# EAGLE schematic Debug Tester rev B (EAGLE 9.7.0)
COMPANY: ADAFRUIT INDUSTRIES; DRAWN: KTOWN; REV: B
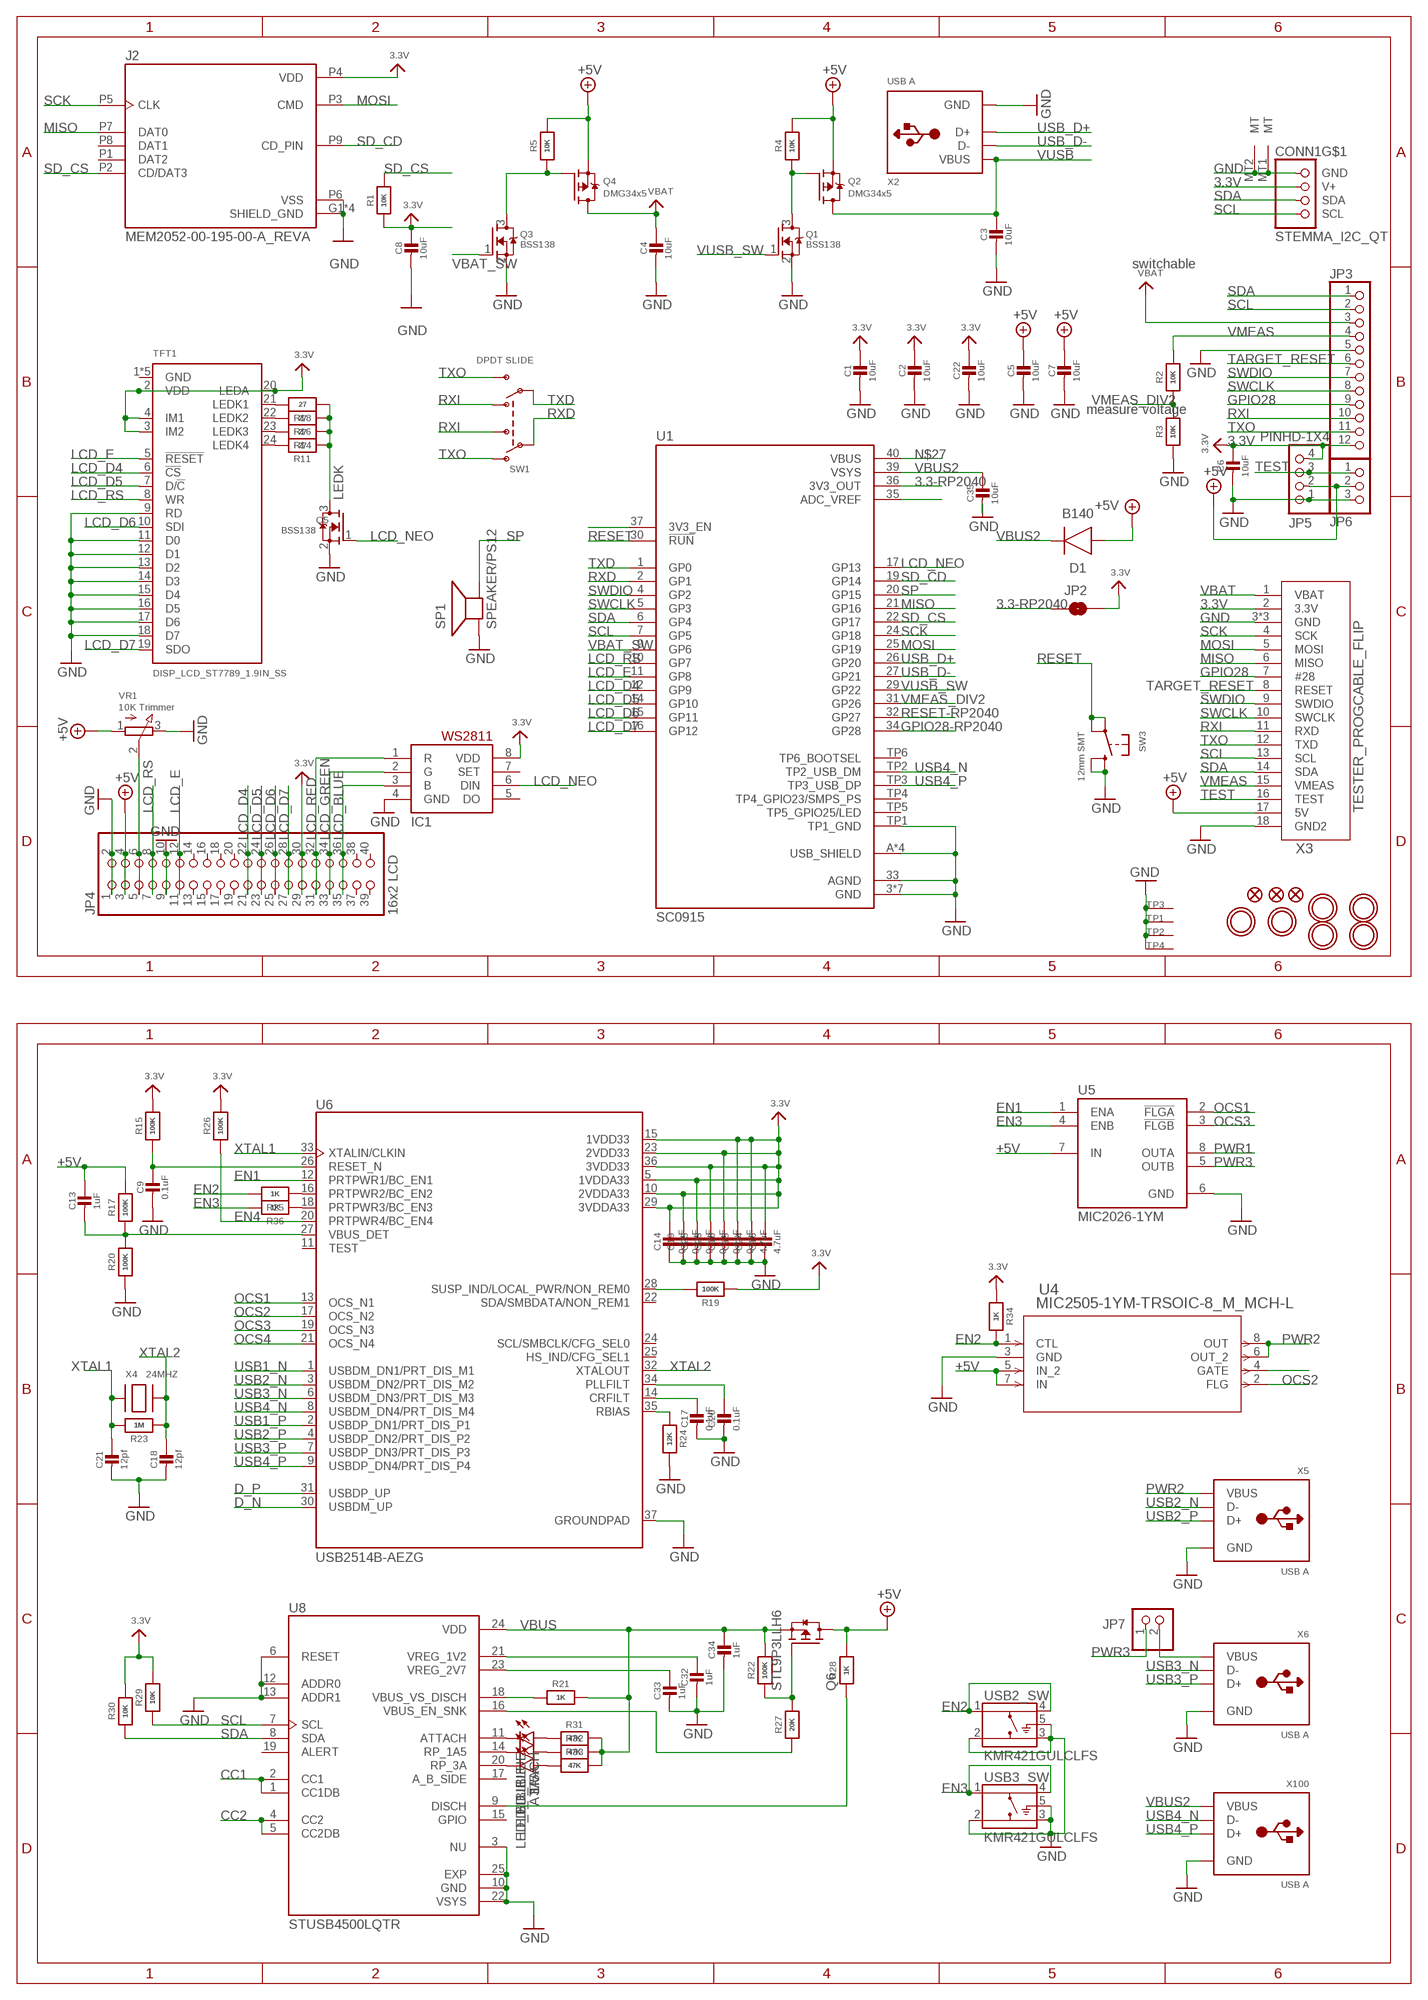
[diagram p0: schematic, sheet 1, part 1 of 2]
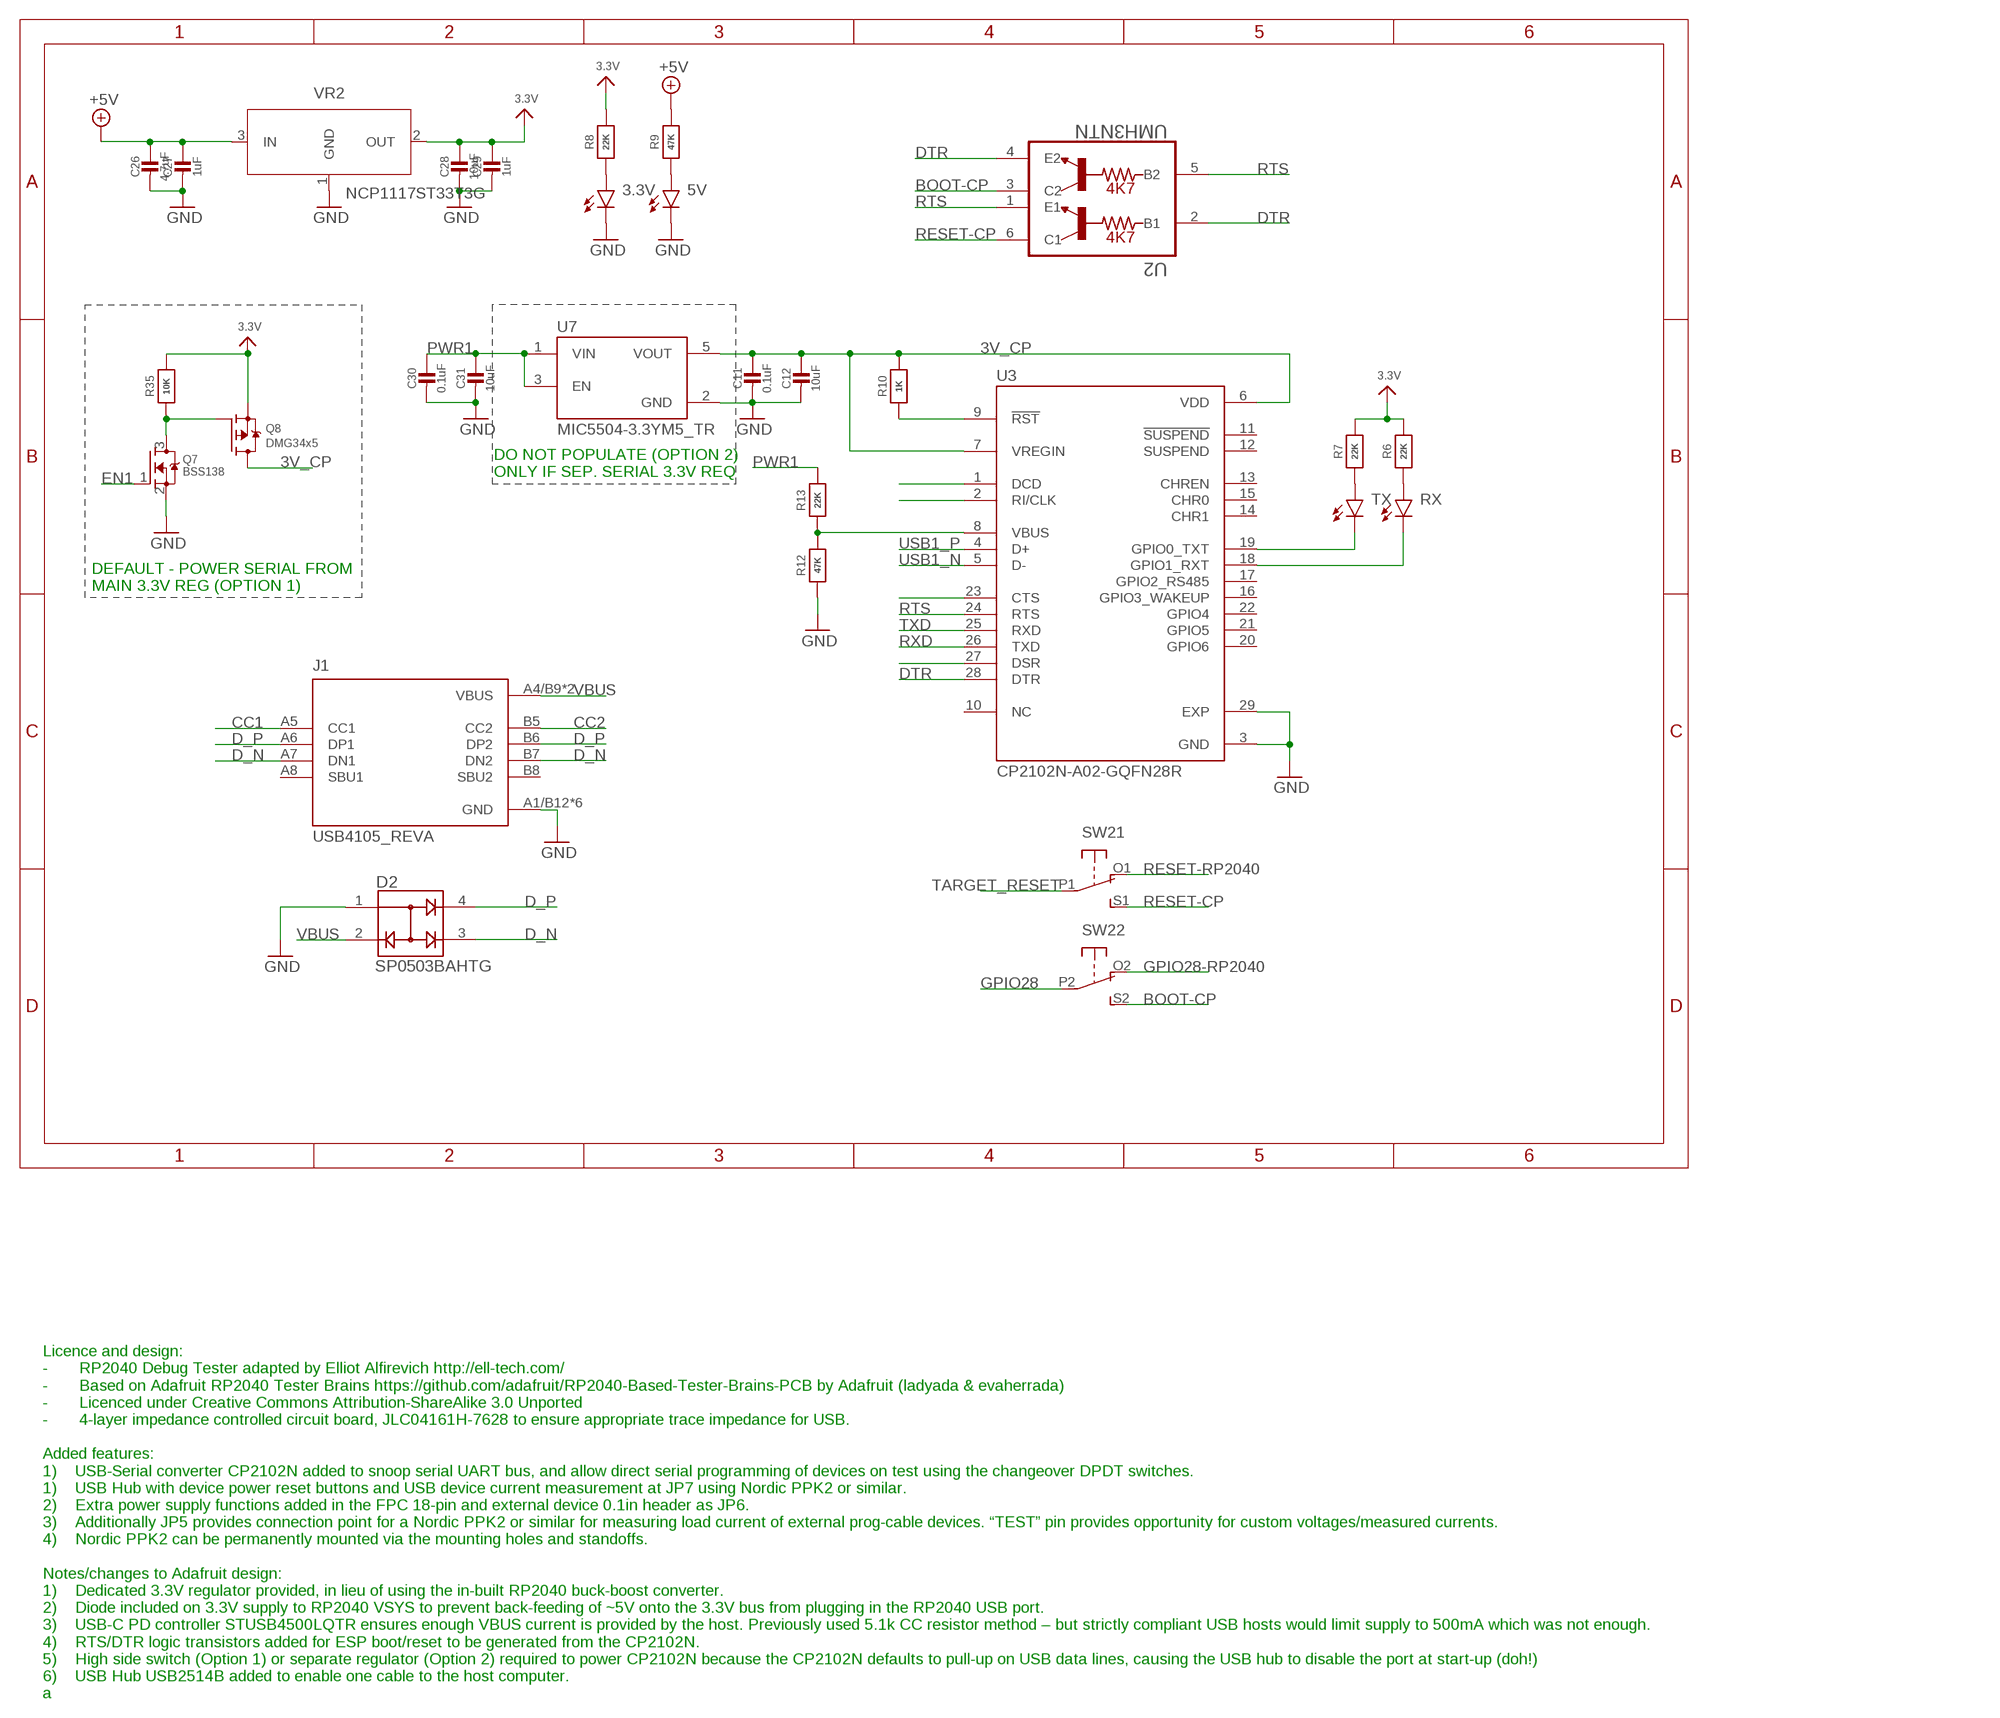
[diagram p1: schematic, sheet 1, part 2 of 2]

## Parts
1.5A  LED_BLUE  CHIP-FLAT-B_0603-0.55MM  [LEDC1608X55N_FLAT-B]
3.3V  LED_BLUE  CHIP-FLAT-B_0603-0.55MM  [LEDC1608X55N_FLAT-B]
3A  LED_BLUE  CHIP-FLAT-B_0603-0.55MM  [LEDC1608X55N_FLAT-B]
5V  LED_BLUE  CHIP-FLAT-B_0603-0.55MM  [LEDC1608X55N_FLAT-B]
$$U$1  MOUNTINGHOLE3.0THIN  [MOUNTINGHOLE_3.0_PLATEDTHIN]
$$U$2  MOUNTINGHOLE3.0THIN  [MOUNTINGHOLE_3.0_PLATEDTHIN]
$$U$3  MOUNTINGHOLE3.0THIN  [MOUNTINGHOLE_3.0_PLATEDTHIN]
$$U$5  MOUNTINGHOLE3.0THIN  [MOUNTINGHOLE_3.0_PLATEDTHIN]
$$U$6  MOUNTINGHOLE3.0THIN  [MOUNTINGHOLE_3.0_PLATEDTHIN]
ATTACH  LED_BLUE  CHIP-FLAT-B_0603-0.55MM  [LEDC1608X55N_FLAT-B]
C1  10uF  CAP_CERAMIC0603_NO  [0603-NO]
C2  10uF  CAP_CERAMIC0603_NO  [0603-NO]
C3  10uF  CAP_CERAMIC0603_NO  [0603-NO]
C4  10uF  CAP_CERAMIC0603_NO  [0603-NO]
C5  10uF  CAP_CERAMIC0603_NO  [0603-NO]
C6  10uF  CAP_CERAMIC0603_NO  [0603-NO]
C7  10uF  CAP_CERAMIC0603_NO  [0603-NO]
C8  10uF  CAP_CERAMIC0603_NO  [0603-NO]
C9  0.1uF  CAP_CERAMIC0603_NO  [0603-NO]
C10  0.1uF  CAP_CERAMIC0603_NO  [0603-NO]
C11  0.1uF  CAP_CERAMIC0603_NO  [0603-NO]
C12  10uF  CAP_CERAMIC0603_NO  [0603-NO]
C13  1uF  CAP_CERAMIC0603_NO  [0603-NO]
C14  0.1uF  CAP_CERAMIC0603_NO  [0603-NO]
C15  0.1uF  CAP_CERAMIC0603_NO  [0603-NO]
C16  4.7uF  CAP_CERAMIC0603_NO  [0603-NO]
C17  0.1uF  CAP_CERAMIC0603_NO  [0603-NO]
C18  12pf  CAP_CERAMIC0603_NO  [0603-NO]
C19  0.1uF  CAP_CERAMIC0603_NO  [0603-NO]
C20  0.1uF  CAP_CERAMIC0603_NO  [0603-NO]
C21  12pf  CAP_CERAMIC0603_NO  [0603-NO]
C22  10uF  CAP_CERAMIC0603_NO  [0603-NO]
C23  0.1uF  CAP_CERAMIC0603_NO  [0603-NO]
C24  4.7uF  CAP_CERAMIC0603_NO  [0603-NO]
C25  0.1uF  CAP_CERAMIC0603_NO  [0603-NO]
C26  4.7uF  CAP_CERAMIC0603_NO  [0603-NO]
C27  1uF  CAP_CERAMIC0603_NO  [0603-NO]
C28  10uF  CAP_CERAMIC0603_NO  [0603-NO]
C29  1uF  CAP_CERAMIC0603_NO  [0603-NO]
C30  0.1uF  CAP_CERAMIC0603_NO  [0603-NO]
C31  10uF  CAP_CERAMIC0603_NO  [0603-NO]
C32  1uF  CAP_CERAMIC0603_NO  [0603-NO]
C33  1uF  CAP_CERAMIC0603_NO  [0603-NO]
C34  1uF  CAP_CERAMIC0603_NO  [0603-NO]
C35  10uF  CAP_CERAMIC0603_NO  [0603-NO]
CONN1  STEMMA_I2C_QT  [JST_SH4]
D1  B140  DIODE_ES1D_SMA  [DIOM5226X290N]
D2  SP0503BAHTG  [SOT143]
FID1  FIDUCIAL_1MM  [FIDUCIAL_1MM]
FID2  FIDUCIAL_1MM  [FIDUCIAL_1MM]
FID3  FIDUCIAL_1MM  [FIDUCIAL_1MM]
IC1  WS2811-SOP8  [SO08-SKINNYPADS]
J1  USB4105_REVA  [GCT_USB4105_REVA]
J2  MEM2052-00-195-00-A_REVA  [GCT_MEM2052-00-195-00-A_REVA]
JP2  JUMPER-SMT_2_NC_PASTE_NO-SILK  JUMPER-SMT_2_NO_NO-SILK  [SMT-JUMPER_2_NO_NO-SILK]
JP3  HEADER-1X12OVAL  [1X12_OVAL]
JP4  16x2 LCD  PINHD-2X20_SMT  [2X20_SMT_MALE]
JP5  PINHD-1X4  [1X04]
JP6  PINHD-1X3/90  [1X03/90]
JP7  PINHD-1X2  [1X02]
Q1  BSS138  MOSFET-NWIDE  [SOT23-WIDE]
Q2  DMG34x5  MOSFET-PWIDE  [SOT23-WIDE]
Q3  BSS138  MOSFET-NWIDE  [SOT23-WIDE]
Q4  DMG34x5  MOSFET-PWIDE  [SOT23-WIDE]
Q5  BSS138  MOSFET-NWIDE  [SOT23-WIDE]
Q6  STL9P3LLH6  [TRANS_STL9P3LLH6]
Q7  BSS138  MOSFET-NWIDE  [SOT23-WIDE]
Q8  DMG34x5  MOSFET-PWIDE  [SOT23-WIDE]
R1  10K  RESISTOR_0603_NOOUT  [0603-NO]
R2  10K  RESISTOR_0603_NOOUT  [0603-NO]
R3  10K  RESISTOR_0603_NOOUT  [0603-NO]
R4  10K  RESISTOR_0603_NOOUT  [0603-NO]
R5  10K  RESISTOR_0603_NOOUT  [0603-NO]
R6  22K  RESISTOR_0603_NOOUT  [0603-NO]
R7  22K  RESISTOR_0603_NOOUT  [0603-NO]
R8  22K  RESISTOR_0603_NOOUT  [0603-NO]
R9  47K  RESISTOR_0603_NOOUT  [0603-NO]
R10  1K  RESISTOR_0603_NOOUT  [0603-NO]
R11  27  RESISTOR_0603_NOOUT  [0603-NO]
R12  47K  RESISTOR_0603_NOOUT  [0603-NO]
R13  22K  RESISTOR_0603_NOOUT  [0603-NO]
R14  27  RESISTOR_0603_NOOUT  [0603-NO]
R15  100K  RESISTOR_0603_NOOUT  [0603-NO]
R16  27  RESISTOR_0603_NOOUT  [0603-NO]
R17  100K  RESISTOR_0603_NOOUT  [0603-NO]
R18  27  RESISTOR_0603_NOOUT  [0603-NO]
R19  100K  RESISTOR_0603_NOOUT  [0603-NO]
R20  100K  RESISTOR_0603_NOOUT  [0603-NO]
R21  1K  RESISTOR_0603_NOOUT  [0603-NO]
R22  100K  RESISTOR_0603_NOOUT  [0603-NO]
R23  1M  RESISTOR_0603_NOOUT  [0603-NO]
R24  12K  RESISTOR_0603_NOOUT  [0603-NO]
R25  1K  RESISTOR_0603_NOOUT  [0603-NO]
R26  100K  RESISTOR_0603_NOOUT  [0603-NO]
R27  20K  RESISTOR_0603_NOOUT  [0603-NO]
R28  1K  RESISTOR_0603_NOOUT  [0603-NO]
R29  10K  RESISTOR_0603_NOOUT  [0603-NO]
R30  10K  RESISTOR_0603_NOOUT  [0603-NO]
R31  47K  RESISTOR_0603_NOOUT  [0603-NO]
R32  47K  RESISTOR_0603_NOOUT  [0603-NO]
R33  47K  RESISTOR_0603_NOOUT  [0603-NO]
R34  1K  RESISTOR_0603_NOOUT  [0603-NO]
R35  10K  RESISTOR_0603_NOOUT  [0603-NO]
R36  1K  RESISTOR_0603_NOOUT  [0603-NO]
RX  LED_BLUE  CHIP-FLAT-B_0603-0.55MM  [LEDC1608X55N_FLAT-B]
SP1  SPEAKER/PS12  [PS12]
SW1  DPDT SLIDE  SWITCH_DPDTEG1390  [EG1390]
SW2  DPDT-EG1390  [EG1390]
SW3  12mm SMT  SWITCH_TACT_SMT_12MM  [B3F-40XX-SMT]
TFT1  DISP_LCD_ST7789_1.9IN_SS  [TFT_1.9IN_170X320_30P_SS]
TP1  SEWTAP_SMTNUTM3  [SMT_NUT_3MM]
TP2  SEWTAP_SMTNUTM3  [SMT_NUT_3MM]
TP3  SEWTAP_SMTNUTM3  [SMT_NUT_3MM]
TP4  SEWTAP_SMTNUTM3  [SMT_NUT_3MM]
TX  LED_BLUE  CHIP-FLAT-B_0603-0.55MM  [LEDC1608X55N_FLAT-B]
U1  SC0915  [MODULE_SC0915]
U2  UMH3NTN  [SOP65P210X100-6N]
U3  CP2102N-A02-GQFN28R  [IC_CP2102N-A02-GQFN28R]
U4  MIC2505-1YM-TRSOIC-8_M_MCH-L  [SOIC-8_M_MCH-L]
U5  MIC2026-1YM  [SOIC127P599X173-8N]
U6  USB2514B-AEZG  [VQFN50P600X600X100-36N]
U7  MIC5504-3.3YM5_TR  [SOT95P280X145-5N]
U8  STUSB4500LQTR  [QFN50P400X400X100-25N]
U$7  MOUNTINGHOLE3.0THIN  [MOUNTINGHOLE_3.0_PLATEDTHIN]
USB2_SW  KMR421GULCLFS  [SW_KMR421GULCLFS]
USB3_SW  KMR421GULCLFS  [SW_KMR421GULCLFS]
VR1  10K Trimmer  TRIMPOTTC33X-2  [TRIMPOT_BOURNS_TC33X-2]
VR2  NCP1117ST33T3G  NCP1117ST33T3GSOT-223  [SOT230P700X170-4]
X2  USB A  USB_TYPEA_SMT  [USB_HOST-SMT]
X3  TESTER_PROGCABLE_FLIP  [FPC_0.5MM_18PIN]
X4  24MHZ  XTALNX5032  [NX5032]
X5  USB A  USB_TYPEA_SMT  [USB_HOST-SMT]
X6  USB A  USB_TYPEA_SMT  [USB_HOST-SMT]
X100  USB A  USB_TYPEA_SMT  [USB_HOST-SMT]

## Nets
3.3-RP2040: JP2.1 U1.36(3V3_OUT)
3.3V: C1.1 C2.1 C6.1 C8.1 C10.1 C14.1 C15.1 C16.1 C19.1 C22.1 C23.1 C24.1 C25.1 C28.1 C29.1 CONN1.2(V+) IC1.8(VDD) J2.P4(VDD) JP2.2 JP3.12 JP4.29 JP4.30 JP5.4 Q8.2(S) R1.1 R6.2 R7.2 R8.2 R15.2 R19.1 R26.2 R29.2 R30.2 R34.1 R35.2 TFT1.2(VDD) TFT1.3(IM2) TFT1.4(IM1) TFT1.20(LEDA) U6.5(1VDDA33) U6.10(2VDDA33) U6.15(1VDD33) U6.23(2VDD33) U6.29(3VDDA33) U6.36(3VDD33) VR2.2(OUT) X3.2(3.3V)
3V_CP: C11.1 C12.1 Q8.3(D) R10.2 U3.6(VDD) U3.7(VREGIN) U7.5(VOUT)
!VBAT_SW1: Q3.3(D) Q4.1(G) R5.1
!VBAT_SW2: Q1.3(D) Q2.1(G) R4.1
+5V: C5.1 C7.1 C13.1 C26.1 C27.1 D1.2(A) JP4.3 JP4.4 JP5.2 JP6.2 Q2.2(S) Q4.2(S) Q6.5(D) Q6.5_1(D) Q6.5_2(D) R4.2 R5.2 R9.2 R17.2 R28.2 U4.5(IN_2) U4.7(IN) U5.7(IN) VR1.1(A) VR2.3(IN) X3.17(5V)
BOOT-CP: SW2.S2(2:S) U2.3(C2)
CC1: J1.A5(CC1) U8.1(CC1DB) U8.2(CC1)
CC2: J1.B5(CC2) U8.4(CC2) U8.5(CC2DB)
D_N: D2.3 J1.A7(DN1) J1.B7(DN2) U6.30(USBDM_UP)
D_P: D2.4 J1.A6(DP1) J1.B6(DP2) U6.31(USBDP_UP)
DTR: U2.2(B1) U2.4(E2) U3.28(DTR)
EN1: Q7.1(G) U5.1(ENA) U6.12(PRTPWR1/BC_EN1)
EN2: R25.2 R34.2 U4.1(CTL) USB2_SW.1 USB2_SW.4
EN3: R36.2 U5.4(ENB) USB3_SW.1 USB3_SW.4
EN4: R26.1 U6.20(PRTPWR4/BC_EN4)
GND: 3.3V.C 5V.C C1.2 C2.2 C3.2 C4.2 C5.2 C6.2 C7.2 C8.2 C9.2 C10.2 C11.2 C12.2 C14.2 C15.2 C16.2 C17.2 C18.2 C19.2 C20.2 C21.2 C22.2 C23.2 C24.2 C25.2 C26.2 C27.2 C28.2 C29.2 C30.2 C31.2 C32.2 C33.2 C34.2 C35.2 CONN1.1(GND) CONN1.MT1(MT) CONN1.MT2(MT) D2.1 IC1.4(GND) J1.A1/B12(GND) J1.B1/A12(GND) J1.G1(GND) J1.G2(GND) J1.G3(GND) J1.G4(GND) J2.G1(SHIELD_GND) J2.G2(SHIELD_GND) J2.G3(SHIELD_GND) J2.G4(SHIELD_GND) J2.P6(VSS) JP3.5 JP4.1 JP4.2 JP4.9 JP4.10 JP5.1 JP6.3 Q1.2(S) Q3.2(S) Q5.2(S) Q7.2(S) R3.1 R12.1 R20.1 R24.2 SP1.P$1(+) SW3.P$3(S) SW3.P$4(S1) TFT1.9(RD) TFT1.11(D0) TFT1.12(D1) TFT1.13(D2) TFT1.14(D3) TFT1.15(D4) TFT1.16(D5) TFT1.17(D6) TFT1.18(D7) TP1.P$1(SEW) TP2.P$1(SEW) TP3.P$1(SEW) TP4.P$1(SEW) U1.3(GND) U1.8(GND) U1.13(GND) U1.18(GND) U1.23(GND) U1.28(GND) U1.33(AGND) U1.38(GND) U1.A(USB_SHIELD) U1.B(USB_SHIELD) U1.C(USB_SHIELD) U1.D(USB_SHIELD) U1.TP1(TP1_GND) U3.3(GND) U3.29(EXP) U4.3(GND) U5.6(GND) U6.37(GROUNDPAD) U7.2(GND) U8.3(NU) U8.6(RESET) U8.10(GND) U8.12(ADDR0) U8.13(ADDR1) U8.22(VSYS) U8.25(EXP) USB2_SW.2 USB2_SW.3 USB2_SW.5(G) USB3_SW.2 USB3_SW.3 USB3_SW.5(G) VR1.3(E) VR2.1(GND) X2.GND X3.3(GND) X3.18(GND2) X3.SUPPORT1(GND) X3.SUPPORT2(GND) X5.GND X6.GND X100.GND
GPIO28: JP3.9 SW2.P2(2:P) X3.7(#28)
GPIO28-RP2040: SW2.O2(2:O) U1.34(GP28)
LCD_BLUE: IC1.3(B) JP4.35 JP4.36
LCD_D4: JP4.21 JP4.22 TFT1.6(!CS) U1.12(GP9)
LCD_D5: JP4.23 JP4.24 TFT1.7(D/!C) U1.14(GP10)
LCD_D6: JP4.25 JP4.26 TFT1.10(SDI) U1.15(GP11)
LCD_D7: JP4.27 JP4.28 TFT1.19(SDO) U1.16(GP12)
LCD_E: JP4.11 JP4.12 TFT1.5(!RESET) U1.11(GP8)
LCD_GREEN: IC1.2(G) JP4.33 JP4.34
LCD_NEO: IC1.6(DIN) Q5.1(G) U1.17(GP13)
LCD_RED: IC1.1(R) JP4.31 JP4.32
LCD_RS: JP4.7 JP4.8 TFT1.8(WR) U1.10(GP7)
LEDK: Q5.3(D) R11.1 R14.1 R16.1 R18.1
MISO: J2.P7(DAT0) U1.21(GP16) X3.6(MISO)
MOSI: J2.P3(CMD) U1.25(GP19) X3.5(MOSI)
N$1: R25.1 U6.16(PRTPWR2/BC_EN2)
N$2: R18.2 TFT1.21(LEDK1)
N$3: R16.2 TFT1.22(LEDK2)
N$4: R14.2 TFT1.23(LEDK3)
N$5: R11.2 TFT1.24(LEDK4)
N$6: JP4.5 JP4.6 VR1.2(S)
N$7: R10.1 U3.9(!RST)
N$8: C13.2 R17.1 R20.2 U6.27(VBUS_DET)
N$9: U3.1(DCD)
N$10: U3.2(RI/CLK)
N$11: R12.2 R13.1 U3.8(VBUS)
N$12: TX.C U3.19(GPIO0_TXT)
N$13: RX.C U3.18(GPIO1_RXT)
N$14: U3.23(CTS)
N$15: R7.1 TX.A
N$16: R6.1 RX.A
N$17: C9.1 R15.1 U6.26(RESET_N)
N$18: U3.27(DSR)
N$19: C17.1 U6.14(CRFILT)
N$20: C20.1 U6.34(PLLFILT)
N$21: ATTACH.C U8.11(ATTACH)
N$22: C33.1 U8.23(VREG_2V7)
N$23: R24.1 U6.35(RBIAS)
N$24: R19.2 U6.28(SUSP_IND/LOCAL_PWR/NON_REM0)
N$25: C32.1 U8.21(VREG_1V2)
N$26: R36.1 U6.18(PRTPWR3/BC_EN3)
N$27: U1.40(VBUS)
N$29: 1.5A.C U8.14(RP_1A5)
N$30: R21.1 U8.18(VBUS_VS_DISCH)
N$31: Q6.4(G) R22.1 R27.2
N$32: 3.3V.A R8.1
N$33: 5V.A R9.1
N$34: JP7.2 X6.VBUS
N$35: 3A.C U8.20(RP_3A)
N$36: R28.1 U8.9(DISCH)
N$37: R27.1 U8.16(VBUS_EN_SNK)
N$38: ATTACH.A R31.1
N$39: 1.5A.A R32.1
N$40: 3A.A R33.1
N$42: Q7.3(D) Q8.1(G) R35.1
N$44: U1.37(3V3_EN)
N$46: U4.4(GATE)
N$52: U1.35(ADC_VREF)
OCS1: U5.2(!FLGA) U6.13(OCS_N1)
OCS2: U4.2(FLG) U6.17(OCS_N2)
OCS3: U5.3(!FLGB) U6.19(OCS_N3)
OCS4: U6.21(OCS_N4)
PWR1: C30.1 C31.1 R13.2 U5.8(OUTA) U7.1(VIN) U7.3(EN)
PWR2: U4.6(OUT_2) U4.8(OUT) X5.VBUS
PWR3: JP7.1 U5.5(OUTB)
RESET: SW3.P$1(P) SW3.P$2(P1) U1.30(!RUN)
RESET-CP: SW2.S1(1:S) U2.6(C1)
RESET-RP2040: SW2.O1(1:O) U1.32(GP27)
RTS: U2.1(E1) U2.5(B2) U3.24(RTS)
RXD: SW1.P1 U1.2(GP1) U3.26(TXD)
RXI: JP3.10 SW1.O2 SW1.S1 X3.11(RXD)
SCK: J2.P5(CLK) U1.24(GP18) X3.4(SCK)
SCL: CONN1.4(SCL) JP3.2 R29.1 U1.7(GP5) U8.7(SCL) X3.13(SCL)
SD_CD: J2.P9(CD_PIN) U1.19(GP14)
SD_CS: J2.P2(CD/DAT3) R1.2 U1.22(GP17)
SDA: CONN1.3(SDA) JP3.1 R30.1 U1.6(GP4) U8.8(SDA) X3.14(SDA)
SP: SP1.P$2(-) U1.20(GP15)
SWCLK: JP3.8 U1.5(GP3) X3.10(SWCLK)
SWDIO: JP3.7 U1.4(GP2) X3.9(SWDIO)
TARGET_RESET: JP3.6 SW2.P1(1:P) X3.8(RESET)
TEST: JP5.3 JP6.1 X3.16(TEST)
TXD: SW1.P2 U1.1(GP0) U3.25(RXD)
TXO: JP3.11 SW1.O1 SW1.S2 X3.12(TXD)
USB1_N [USB2]: U3.5(D-) U6.1(USBDM_DN1/PRT_DIS_M1)
USB1_P [USB2]: U3.4(D+) U6.2(USBDP_DN1/PRT_DIS_P1)
USB2_N [USB2]: U6.3(USBDM_DN2/PRT_DIS_M2) X5.D-
USB2_P [USB2]: U6.4(USBDP_DN2/PRT_DIS_P2) X5.D+
USB3_N [USB2]: U6.6(USBDM_DN3/PRT_DIS_M3) X6.D-
USB3_P [USB2]: U6.7(USBDP_DN3/PRT_DIS_P3) X6.D+
USB4_N [USB2]: U1.TP2(TP2_USB_DM) U6.8(USBDM_DN4/PRT_DIS_M4) X100.D-
USB4_P [USB2]: U1.TP3(TP3_USB_DP) U6.9(USBDP_DN4/PRT_DIS_P4) X100.D+
USB_D+: U1.26(GP20) X2.D+
USB_D-: U1.27(GP21) X2.D-
VBAT: C4.1 JP3.3 Q4.3(D) X3.1(VBAT)
VBAT_SW: Q3.1(G) U1.9(GP6)
VBUS: C34.1 D2.2 J1.A4/B9(VBUS) J1.B4/A9(VBUS) Q6.1(S) Q6.2(S) Q6.3(S) R21.2 R22.2 R31.2 R32.2 R33.2 U8.24(VDD)
VBUS2: C35.1 D1.1(C) U1.39(VSYS) X100.VBUS
VMEAS: JP3.4 R2.2 X3.15(VMEAS)
VMEAS_DIV2: R2.1 R3.2 U1.31(GP26)
VUSB: C3.1 Q2.3(D) X2.VBUS
VUSB_SW: Q1.1(G) U1.29(GP22)
XTAL1: C21.1 R23.2 U6.33(XTALIN/CLKIN) X4.P$1
XTAL2: C18.1 R23.1 U6.32(XTALOUT) X4.P$2
Unconnected: IC1.5(DO) IC1.7(SET) J1.A8(SBU1) J1.B8(SBU2) J2.P1(DAT2) J2.P8(DAT1) JP4.13 JP4.14 JP4.15 JP4.16 JP4.17 JP4.18 JP4.19 JP4.20 JP4.37 JP4.38 JP4.39 JP4.40 U1.TP4(TP4_GPIO23/SMPS_PS) U1.TP5(TP5_GPIO25/LED) U1.TP6(TP6_BOOTSEL) U3.10(NC) U3.11(!SUSPEND) U3.12(SUSPEND) U3.13(CHREN) U3.14(CHR1) U3.15(CHR0) U3.16(GPIO3_WAKEUP) U3.17(GPIO2_RS485) U3.20(GPIO6) U3.21(GPIO5) U3.22(GPIO4) U6.11(TEST) U6.22(SDA/SMBDATA/NON_REM1) U6.24(SCL/SMBCLK/CFG_SEL0) U6.25(HS_IND/CFG_SEL1) U8.15(GPIO) U8.17(A_B_SIDE) U8.19(ALERT)

## Notes on the sheet
- switchable
- DO NOT POPULATE (OPTION 2)
  ONLY IF SEP. SERIAL 3.3V REQ
- measure voltage
- DEFAULT - POWER SERIAL FROM
  MAIN 3.3V REG (OPTION 1)
- Licence and design: 
  -       RP2040 Debug Tester adapted by Elliot Alfirevich http://ell-tech.com/ 
  -       Based on Adafruit RP2040 Tester Brains https://github.com/adafruit/RP2040-Based-Tester-Brains-PCB by Adafruit (ladyada & evaherrada) 
  -       Licenced under Creative Commons Attribution-ShareAlike 3.0 Unported 
  -       4-layer impedance controlled circuit board, JLC04161H-7628 to ensure appropriate trace impedance for USB. 
    
  Added features: 
  1)    USB-Serial converter CP2102N added to snoop serial UART bus, and allow direct serial programming of devices on test using the changeover DPDT switches. 
  1)    USB Hub with device power reset buttons and USB device current measurement at JP7 using Nordic PPK2 or similar. 
  2)    Extra power supply functions added in the FPC 18-pin and external device 0.1in header as JP6. 
  3)    Additionally JP5 provides connection point for a Nordic PPK2 or similar for measuring load current of external prog-cable devices. “TEST” pin provides opportunity for custom voltages/measured currents. 
  4)    Nordic PPK2 can be permanently mounted via the mounting holes and standoffs. 
    
  Notes/changes to Adafruit design: 
  1)    Dedicated 3.3V regulator provided, in lieu of using the in-built RP2040 buck-boost converter. 
  2)    Diode included on 3.3V supply to RP2040 VSYS to prevent back-feeding of ~5V onto the 3.3V bus from plugging in the RP2040 USB port. 
  3)    USB-C PD controller STUSB4500LQTR ensures enough VBUS current is provided by the host. Previously used 5.1k CC resistor method – but strictly compliant USB hosts would limit supply to 500mA which was not enough. 
  4)    RTS/DTR logic transistors added for ESP boot/reset to be generated from the CP2102N. 
  5)    High side switch (Option 1) or separate regulator (Option 2) required to power CP2102N because the CP2102N defaults to pull-up on USB data lines, causing the USB hub to disable the port at start-up (doh!) 
  6)    USB Hub USB2514B added to enable one cable to the host computer. 
  a.     Port 1 – CP2102N USB-Serial converter 
  b.     Port 2 – USB port inc. 1.5A charging 
  c.     Port 3 – USB port inc. 500mA power measurement via jumper JP7 
  d.     Port 4 – RP2040 via test points. 
  7)    USB Hub controller strapped to report Port 1 as “non-removable” and enable USB charging support on Port 2. 
  8)    USB Hub controller requires an external crystal and 1M resistor. Check as newer QFN packages don’t require this resistor. 
  9)    SD card changed due to part availability. Note new part changes card detect from NO to NC which requires change in Brains library code. 
  10) TFT connection not tested. Directly copied from original design.

## Power pins joined to a net without a drawn wire
GND: TFT1.1(GND) TFT1.25(GND) TFT1.30(GND) TFT1.MNT1(GND) TFT1.MNT2(GND)

## Library data of the parts
1.5A 3.3V 3A 5V ATTACH RX TX = LED:CHIP-FLAT-B; CATEGORY: LED; COLOR: BLUE; DESCRIPTION: CHIP LED FLAT; SUB-CATEGORY: CHIP; TYPE: FLAT_TOP
$$U$1-$$U$3 $$U$5 $$U$6 U$7 = adafruit_electromech:MOUNTINGHOLE: Mounting Hole For #2 screws (0.086"/2.18mm width, 0.094"/2.4mm hole) use 2.5mm; BOM: EXCLUDE
C1-C35 = microbuilder:CAP_CERAMIC: Ceramic Capacitors For new designs, use the packages preceded by an '_' character since they are more reliable: The following footprints should be used on most boards: _0402 - Standard footprint for regular board layouts _0603 - Standard footprint for regular board layouts _0805 - Standard footprint for regular board layouts _1206 - Standard footprint for regular board layouts For extremely tight-pitch boards where space is at a premium, the following 'micro-pitch' footprints can be used (smaller pads, no silkscreen outline, etc.): _0402MP - Micro-pitch footprint for very dense/compact boards _0603MP - Micro-pitch footprint for very dense/compact boards _0805MP - Micro-pitch footprint for very dense/compact boards _1206MP - Micro-pitch footprint for very dense/compact boards
CONN1 = adafruit_electromech:STEMMA_I2C; LCSC: C2845363
D1 = Diode:DIODE_: Diode Rectifier - Popular parts; CATEGORY: Diode; DESCRIPTION: DIODE GEN PURP 200V 1A SMA; MANUFACTURER: ON Semiconductor; SUB-CATEGORY: Rectifier; VALUE: ES1D
D2 = SP0503BAHTG (1):SP0503BAHTG: TVS DIODE 5.5VWM 8.5VC SOT143; AVAILABILITY: Good; DESCRIPTION: TVS DIODE 5.5VWM 8.5VC SOT143; MF: Littelfuse; MP: SP0503BAHTG; PACKAGE: SOT-143 Littelfuse; PARTREV: N/A; PRICE: 0.46 USD; STANDARD: IPC-7351B
FID1-FID3 = microbuilder:FIDUCIAL: Fiducial Alignment Points Various fiducial points for machine vision alignment.; BOM: EXCLUDE
IC1 = adafruit:WS2811
J1 = USB4105_REVA-eja:USB4105_REVA: USB Type C Receptacle for USB 2.0 SMT Type, PCB Top Mount; MANUFACTURER: GCT; MAXIMUM_PACKAGE_HEIGHT: 3.31 mm; PARTREV: 0.2; STANDARD: Manufacturer Recommendations
J2 = MEM2052-00-195-00-A_REVA:MEM2052-00-195-00-A_REVA; MANUFACTURER: Global Connector Technology; MAXIMUM_PACKAGE_HEIGHT: 1.95 mm; PARTREV: A; SNAPEDA_PN: MEM2052-00-195-00-A; STANDARD: Manufacturer Recommendations
JP2 = SparkFun-Jumpers:JUMPER-SMT_2_NO: Normally open jumper This jumper has two pads in close proximity to each other. Apply solder to close the connection. Round pads are easier to solder for beginners, but are a lot larger. SparkFun Product that uses the round pads: SparkFun EL Sequencer <https://www.sparkfun.com/products/12781>
JP3 = microbuilder:HEADER-1X12
JP4 = adafruit_electromech:PINHD-2X20: PIN HEADER
JP5 = Connector:PINHD-1X4: PIN HEADER; CATEGORY: CONNECTOR; SUB-CATEGORY: PIN-HEADER
JP6 = Connector:PINHD-1X3: PIN HEADER; CATEGORY: CONNECTOR; SUB-CATEGORY: PIN-HEADER
JP7 = Connector:PINHD-1X2: PIN HEADER; CATEGORY: CONNECTOR; SUB-CATEGORY: PIN-HEADER
Q1 Q3 Q5 Q7 = microbuilder:MOSFET-N: N-Channel Mosfet LEGEND VDS: Voltage Drain-Source ID: Drain Current RDS(ON): Drain-Source On-State Resistance VGS(TH): Gate-Source Threshold Voltage CISS: Drain-Source Input Capacitance SOT-23 Name VDS ID RDS(ON) VGS(TH) CISS Order Number 2N7002E 60V 260mA 2.5 Ohm 2.5V @ 250uA 26.7pF @ 25V 2N7002ET1GOSTR-ND BSH103 30V 850mA 400 mOhm 400mV @ 1mA 83pF @ 24V BSH103,235-ND BSS138 60V 320mA 1.6 Ohm 1.5V @ 250uA 50pF @ 10V Mouser: 771-BSS138PW115 DMN2075U-7 20V 4.2A 38 mOhm 1V @ 250 uA 594.3pF @ 10V DMN2075U-7DICT-ND * BSS138 good choice for I2C level-shifting POWERPAK 1212-8 Name VDS ID RDS(ON) VGS(TH) CISS Order Number Si7308DN 60V 6A 58 mOhm 3V @ 250uA 665pF @ 15V SI7308DN-T1-E3CT-ND
Q2 Q4 Q8 = microbuilder:MOSFET-P: P-Channel Mosfet LEGEND VDS: Voltage Drain-Source ID: Drain Current RDS(ON): Drain-Source On-State Resistance VGS(TH): Gate-Source Threshold Voltage CISS: Drain-Source Input Capacitance SOT-23 Name VDS ID RDS(ON) VGS(TH) CISS Order Number IRLML5103 30V 760mA 600 mOhm -- 75pF @ 25V Digikey: IRLML5103PBFCT-ND IRLML6401 12V 4.3A 50 mOhm 950mV @ 250µA 830pF @ 10V Digikey: IRLML6401PBFTR-ND NTR0202PL 20V 400mA 800 mOhm 2.3V @ 250uA 70pF @ 5V Digikey: NTR0202PLT1GOSTR-ND NTR4101PT1G 20V 1.8A 85 mOhm 1.2V @ 250uA 675pF @ 10V Digikey: NTR4101PT1GOSCT-ND DMP2004K 20V 600mA 900 mOhm 1V @ 250uA 175pF @ 16V Digikey: DMP2004KDICT-ND PMV65XP 20V 3.9A 76 mOhm 950mV @ 1mA 725pF @ 20V Digikey: 568-2358-2-ND TO-252 Name VDS ID RDS(ON) VGS(TH) CISS Order Number AOD417 30V 25A 34 mOhm 3V @ 250µA 920pF @ 15V Digikey: 785-1106-2-ND PowerPak Name VDS ID RDS(ON) VGS(TH) CISS Order Number AON7401 30V 12A 14 mOhm 3V @ 250µA 2600pF @ 15V Digikey: 785-1302-1-ND
Q6 = STL9P3LLH6:STL9P3LLH6: P-channel -30 V, 12 mOhm typ., -9 A STripFET H6 Power MOSFET in a PowerFLAT 3.3 x 3.3 package; MANUFACTURER: ST Microelectronics; MAXIMUM_PACKAGE_HEIGHT: 0.9mm; PARTREV: 3; STANDARD: Manufacturer recommendations
R1-R10 R12 R13 R15 R17 R19-R36 = microbuilder:RESISTOR: Resistors For new designs, use the packages preceded by an '_' character since they are more reliable: The following footprints should be used on most boards: _0402 - Standard footprint for regular board layouts _0603 - Standard footprint for regular board layouts _0805 - Standard footprint for regular board layouts _1206 - Standard footprint for regular board layouts For extremely tight-pitch boards where space is at a premium, the following 'micro-pitch' footprints can be used (smaller pads, no silkscreen outline, etc.): _0402MP - Micro-pitch footprint for very dense/compact boards _0603MP - Micro-pitch footprint for very dense/compact boards _0805MP - Micro-pitch footprint for very dense/compact boards _1206MP - Micro-pitch footprint for very dense/compact boards
R11 R14 R16 R18 = microbuilder:RESISTOR: Resistors For new designs, use the packages preceded by an '_' character since they are more reliable: The following footprints should be used on most boards: _0402 - Standard footprint for regular board layouts _0603 - Standard footprint for regular board layouts _0805 - Standard footprint for regular board layouts _1206 - Standard footprint for regular board layouts For extremely tight-pitch boards where space is at a premium, the following 'micro-pitch' footprints can be used (smaller pads, no silkscreen outline, etc.): _0402MP - Micro-pitch footprint for very dense/compact boards _0603MP - Micro-pitch footprint for very dense/compact boards _0805MP - Micro-pitch footprint for very dense/compact boards _1206MP - Micro-pitch footprint for very dense/compact boards; LCSC: C25190
SP1 = microbuilder:SPEAKER: SPEAKER Source: Buerklin Added PS12 (for part # PS1240 piezo) http://www.ladyada.net/library/pcb/eaglelibrary.html
SW1 = adafruit_electromech:SWITCH_DPDT: Switch - DPDT A DPDT Switch acts like an SPDT switch, but has a pair of switches instead of just one. Vertical - 0.3A @ 6V SMT - Digikey: JS202011SCQN; LCSC: C318999
SW2 = adafruit:DPDT
SW3 = adafruit_electromech:SWITCH_TACT_SMT: SMT Tact Switches 6x6mm - Digikey: P12940SCT-ND KMR2 (4.6x2.8mm) - Digikey: 401-1426-1-ND EVQ-PQHB55 - Light Touch, 160GF (4.5x4.5mm) - Digikey: P8090SCT-ND KMT0 - KMT021 NGJ LHS (etc.) IP68/Waterproof - Digikey: CKN10289CT-ND
TFT1 = adafruit_display:DISP_LCD_ST7789_1.9IN
TP1-TP4 = adafruit_electromech:SEWTAP
U1 = SC0915:SC0915; MANUFACTURER: Pi Supply; PARTREV: 1.9; SNAPEDA_PN: SC0915; STANDARD: Manufacturer Recommendations
U2 = UMH3NTN:UMH3NTN: Dual NPN BJT with 4.7K Base resistor Datasheet <https://fscdn.rohm.com/en/products/databook/datasheet/discrete/transistor/digital/umh3ntn-e.pdf> BUY NOW <https://www.digikey.ca/en/products/detail/rohm-semiconductor/umh3ntn/659279>; AVAILABILITY: https://www.digikey.ca/en/products/detail/rohm-semiconductor/umh3ntn/659279; DATASHEET: https://fscdn.rohm.com/en/products/databook/datasheet/discrete/transistor/digital/umh3ntn-e.pdf; DESCRIPTION: UMH3N Series 50 V 100 mA Surface Mount Dual NPN Digital Transistor - SC-88; MF: Rohm; MP: UMH3NTN; PACKAGE: SOT-363 Rohm; PRICE: None; ZLIB_AUTHOR: Timothy Kuechler P. Eng. CALGARY
U3 = CP2102N-A02-GQFN28R:CP2102N-A02-GQFN28R; MANUFACTURER: Silicon Labs; MAXIMUM_PACKAGE_HEIGHT: 0.8 mm; PARTREV: 1.5; SNAPEDA_PN: CP2102N-A02-GQFN28R; STANDARD: Manufacturer Recommendations
U4 = MIC2505-1YM:MIC2505-1YM-TR; COPYRIGHT: Copyright (C) 2023 Ultra Librarian. All rights reserved.; DIGI-KEY_PART_NUMBER_1: MIC2505-1YM-CT-ND; DIGI-KEY_PART_NUMBER_2: MIC2505-1YM-DKR-ND; DIGI-KEY_PART_NUMBER_3: MIC2505-1YM-TR-ND; MANUFACTURER_PART_NUMBER: MIC2505-1YM-TR; MFR_NAME: Microchip
U5 = MIC2026-1YM:MIC2026-1YM; MANUFACTURER: Microchip; MAXIMUM_PACKAGE_HEIGHT: 1.73mm; PARTREV: June 2010; SNAPEDA_PN: MIC2026-1YM; STANDARD: IPC-7351B
U6 = USB2514B-AEZG:USB2514B-AEZG: USB2514 Series 3 - 3.6 V Quad Port USB 2.0 Hi-Speed Hub Controller - VQFN-36; MANUFACTURER: Microchip
U7 = MIC5504-3.3YM5_TR:MIC5504-3.3YM5_TR: Linear Voltage Regulator IC 1 Output 300mA SOT-23-5; MANUFACTURER: Microchip; MAXIMUM_PACKAGE_HEIGHT: 1.45mm; PARTREV: 05/14/19; STANDARD: IPC-7351B
U8 = STUSB4500LQTR:STUSB4500LQTR: USB Controller USB 2.0 I²C Interface 24-QFN-EP (4x4); MANUFACTURER: STMicroelectronics; MAXIMUM_PACKAGE_HEIGHT: 1 mm; PARTREV: 4; STANDARD: IPC 7351B
USB2_SW USB3_SW = KMR421GULCLFS:KMR421GULCLFS: Switch Tactile N.O. SPST Round Button Gull Wing 0.05A 32VDC 1VA 200000Cycles 2N SMD Automotive T/R; MANUFACTURER: CnK
VR1 = microbuilder:TRIMPOT: 3-Pin SMT Trimpots Bourns TC33 (X-2) Series 1K - Digikey: TC33X-102ECT-ND 10K - Digikey: TC33X-2-103E 100K - Digikey: TC33X-104ECT-ND Bourns 3303 (W) Series 3mm 10K Single Turn - Digikey: 3303W-103ETR-ND 3mm 100K Single Turn - Digikey: 3303X-104ETR-ND; ROT: 270
VR2 = IC_Power-Management:NCP1117ST33T3G: 1.0 A Low-Dropout Positive Fixed and Adjustable Voltage Regulators Datasheet <https://www.onsemi.com/pub/Collateral/NCP1117-D.PDF>; CATEGORY: IC_Power-Management; MANUFACTURER: ON Semiconductor; MPN: NCP1117ST33T3G; OPERATING_TEMP: 0 to +125 °C; PART_STATUS: Active; ROHS_COMPLIANT: RoHS3 Compliant; SERIES: NCP1117, NCV1117; SUB-CATEGORY: Voltage Regulator; TYPE: Linear
X2 X5 X6 X100 = adafruit_electromech:USB_TYPEA: USB - Type A Connectors Male types stick out and are inserted into a PC or matching females parts (these are the connectors used on USB Memory Sticks, etc.). Female parts are generally used for USB Host and accept a male-type connector. SMT - 4UCON: 10017 PTHFML - Digikey: 609-1045-ND, 4UCon: 05241 PCB - Use 2.0mm thick PCBs with this footprint
X3 = adafruit_electromech:TESTER_PROGCABLE; LCSC: C2856802
X4 = adafruit:XTAL: Low cost SMT crystals, no capacitors included http://www.ladyada.net/library/eagle

## Net classes
1 power: width 0.254 mm
2 USB2: width 0.152 mm, clearance 0.127 mm